# EAGLE design RTC-mini-flip-SHIM (EAGLE 9.6.2)
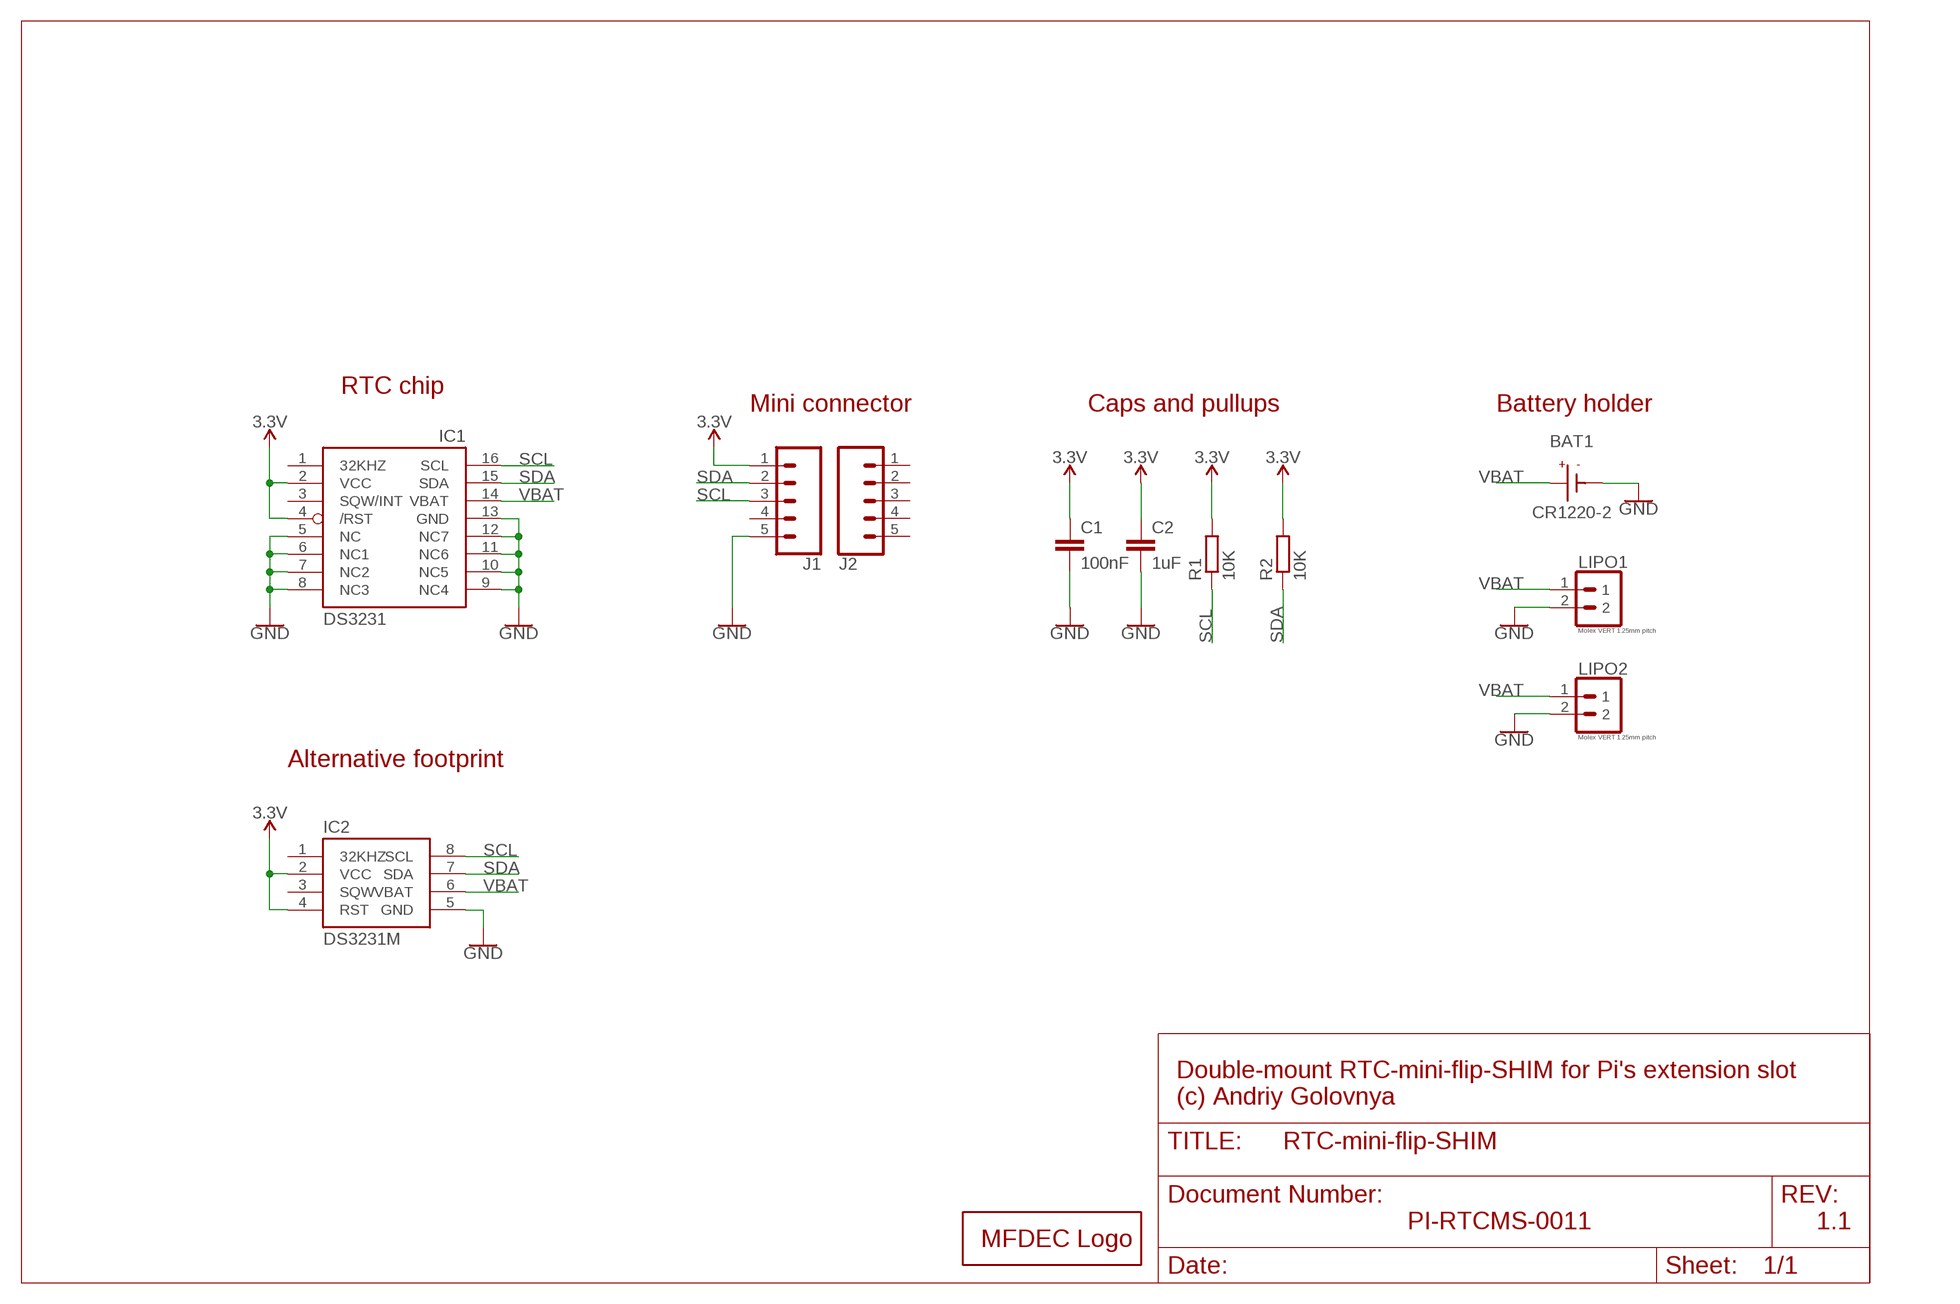
[diagram p0: schematic, sheet 1]

## Parts
BAT1  CR1220-2  [CR1220-2]
C1  100nF  C-EUC0402  [C0402]
C2  1uF  C-EUC0603  [C0603]
IC1  DS3231/SO  [SO16W]
IC2  DS3231M  [SO08]
J1  CONN_05LOCK  [1X05_LOCK]
J2  CONN_05LOCK  [1X05_LOCK]
LIPO1  Molex VERT 1.25mm pitch  1X02_MOLEX_0530470210_VERT-MALE_PITCH-1.25MM  [_MOLEX-0530470210_VERT_PITCH-1.25MM]
LIPO2  Molex VERT 1.25mm pitch  1X02_MOLEX_0530470210_VERT-MALE_PITCH-1.25MM  [_MOLEX-0530470210_VERT_PITCH-1.25MM]
LOGO1  MFDECLOGO_L_10MM  [MFDEC_L_10MM]
R1  10K  R-EU_R0402  [R0402]
R2  10K  R-EU_R0402  [R0402]

## Nets
3.3V: C1.1 C2.1 IC1.2(VCC) IC1.4(/RST) IC2.2(VCC) IC2.4(RST) J1.1 R1.2 R2.2
GND: BAT1.BAT- C1.2 C2.2 IC1.5(NC) IC1.6(NC1) IC1.7(NC2) IC1.8(NC3) IC1.9(NC4) IC1.10(NC5) IC1.11(NC6) IC1.12(NC7) IC1.13(GND) IC2.5(GND) J1.5 LIPO1.2 LIPO2.2
SCL: IC1.16(SCL) IC2.8(SCL) J1.3 R1.1
SDA: IC1.15(SDA) IC2.7(SDA) J1.2 R2.1
VBAT: BAT1.BAT+ IC1.14(VBAT) IC2.6(VBAT) LIPO1.1 LIPO2.1
Unconnected: IC1.1(32KHZ) IC1.3(SQW/INT) IC2.1(32KHZ) IC2.3(SQW) J1.4 J2.1 J2.2 J2.3 J2.4 J2.5

## Notes on the sheet
- RTC chip
- Mini connector | Caps and pullups | Battery holder
- Alternative footprint
- Double-mount RTC-mini-flip-SHIM for Pi's extension slot
  (c) Andriy Golovnya
- PI-RTCMS-0011 | 1.1

## Library data of the parts
BAT1 = CR1220-2:CR1220-2
C1 C2 = rcl:C-EU: CAPACITOR, European symbol; SPICEPREFIX: C
IC1 = adafruit:DS3231
IC2 = SparkFun-Clocks:DS3231M: DS3231M Real Time Clock Accuracy +/-5ppm. Battery Backup. 2.3V to 5.5V. Datasheet <https://cdn.sparkfun.com/datasheets/Dev/Beagle/DS3231M.pdf> SparkFun Products CryptoCape <https://www.sparkfun.com/products/12773> (DEV-12773) SparkFun CryptoShield <https://www.sparkfun.com/products/13183> (DEV-13183); PROD_ID: IC-11985
J1 J2 = _my_locked_connectors:CONN_05: Multi connection point. Often used as Generic Header-pin footprint for 0.1 inch spaced/style header connections On any of the 0.1 inch spaced packages, you can populate with these: Break Away Headers - Straight <https://www.sparkfun.com/products/116> (PRT-00116) Break Away Male Headers - Right Angle <https://www.sparkfun.com/products/553> (PRT-00553) Female Headers <https://www.sparkfun.com/products/115> (PRT-00115) Break Away Headers - Machine Pin <https://www.sparkfun.com/products/117> (PRT-00117) Break Away Female Headers - Swiss Machine Pin <https://www.sparkfun.com/products/743> (PRT-00743) For SCREWTERMINALS and SPRING TERMINALS visit here: Screw Terimnals on SparkFun.com <https://www.sparkfun.com/search/results?term=Screw+Terminals> (5mm/3.5mm/2.54mm spacing) This device is also useful as a general connection point to wire up your design to another part of your project. Our various solder wires solder well into these plated through hole pads. Hook-Up Wire - Assortment (Stranded, 22 AWG) <https://www.sparkfun.com/products/11375> (PRT-11375) Hook-Up Wire - Assortment (Solid Core, 22 AWG) <https://www.sparkfun.com/products/11367> (PRT-11367) View the entire wire category on our website here <https://www.sparkfun.com/categories/141> Special notes: Molex polarized connector foot print use with SKU : PRT-08231 with associated crimp pins and housings. 1MM SMD Version SKU: PRT-10208
LIPO1 LIPO2 = PiB_connectors:1X02_MOLEX; DATASHEET_CONNECTOR1: https://www.molex.com/pdm_docs/sd/530470210_sd.pdf; DATASHEET_CONNECTOR2: https://www.molex.com/pdm_docs/sd/510210700_sd.pdf; DATASHEET_CRIMP: https://www.molex.com/pdm_docs/sd/500798000_sd.pdf; DISTLINK_CONNECTOR1: https://www.digikey.com/products/en?keywords=WM1731-ND; DISTLINK_CONNECTOR2: https://www.digikey.com/products/en?keywords=WM1720-ND; DISTLINK_CRIMP: https://www.digikey.com/products/en?keywords=WM1142CT-ND; DISTPN_CONNECTOR1: WM1731-ND; DISTPN_CONNECTOR2: WM1720-ND; DISTPN_CRIMP: WM1142CT-ND; DIST_CONNECTOR1: Digikey; DIST_CONNECTOR2: Digikey; DIST_CRIMP: Digikey; MFR_CONNECTOR1: Molex, LLC; MFR_CONNECTOR2: Molex, LLC; MFR_CRIMP: Molex, LLC; MPN_CONNECTOR1: 0530470210; MPN_CONNECTOR2: 51021-0200; MPN_CRIMP: 0500798000
LOGO1 = _my_logos:MFDECLOGO: Midnight Fog - Digital Eye Candy LOGO
R1 R2 = rcl:R-EU_: RESISTOR, European symbol; SPICEPREFIX: R

## Board
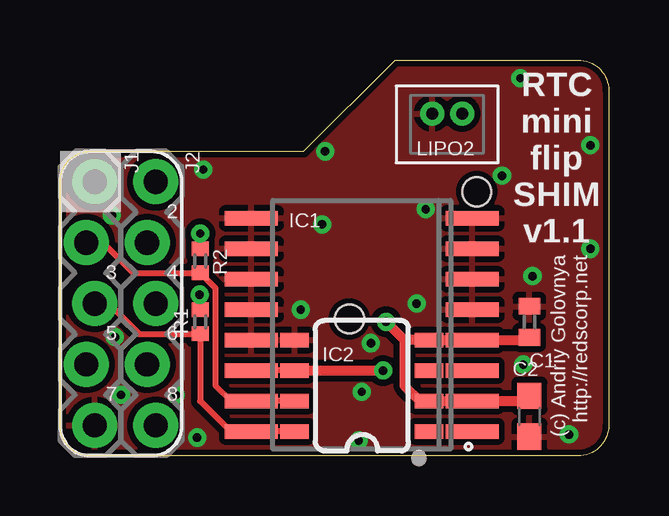
[diagram p1: board, top side]
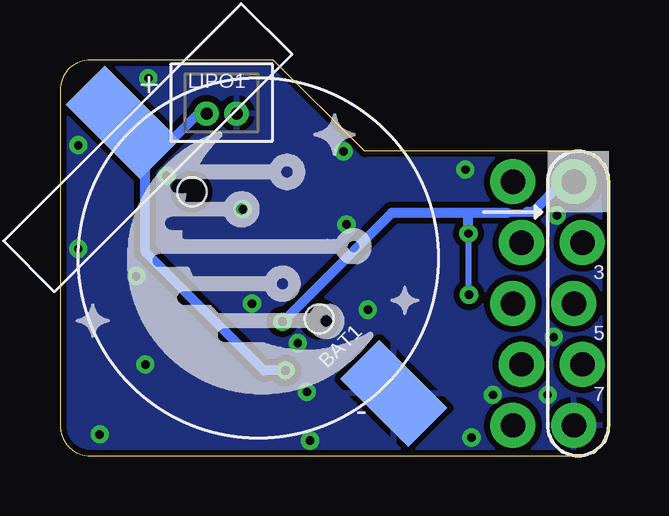
[diagram p2: board, bottom side, seen from below]

Size 22.86 x 16.51 mm. Coordinates in mm from the lower left corner, seen from the top.
Outline: 0,1.27 0,11.43 arc-90 1.27,12.7 10.16,12.7 13.97,16.51 21.59,16.51 arc-90 22.86,15.24 22.86,1.27 arc-90 21.59,0 1.27,0 arc-90 0,1.27
Copper layers (1*16): Top 0.035mm / dielectric 1.5mm / Bottom 0.035mm
Design rules "default *": minimum track width 6mil, minimum drill 0.35mm, track to track 6mil, track to pad 6mil, pad to pad 6mil, via to via 6mil, smd to smd 6mil, copper to edge 6mil, drill to drill 6mil, minimum pad ring 10mil, minimum via ring 8mil, stop-mask expansion 4mil, vias tented up to drill 20mil, thermal gap 10mil

### Footprints (pad centres in the part's own frame; a part is rotated, then mirrored left to right if it is on the bottom)
CR1220-2 = smd 2.3 x 4.4: BAT+ 0,-8 | smd 2.3 x 4: BAT- 0,8 | hole 1.2: 0,3.6; 0,-3.9
C0402 = smd 0.7 x 0.9: 1 -0.65,0; 2 0.65,0
C0603 = smd 1.1 x 1: 1 -0.85,0; 2 0.85,0
SO16W = smd 0.6 x 2.2: 1 -4.445,-4.6; 2 -3.175,-4.6; 3 -1.905,-4.6; 4 -0.635,-4.6; 5 0.635,-4.6; 6 1.905,-4.6; 7 3.175,-4.6; 8 4.445,-4.6; 9 4.445,4.6; 10 3.175,4.6; 11 1.905,4.6; 12 0.635,4.6; 13 -0.635,4.6; 14 -1.905,4.6; 15 -3.175,4.6; 16 -4.445,4.6
SO08 = smd 0.6 x 1.2: 1 -1.905,-2.8; 2 -0.635,-2.8; 3 0.635,-2.8; 4 1.905,-2.8; 5 1.905,2.8; 6 0.635,2.8; 7 -0.635,2.8; 8 -1.905,2.8
1X05_LOCK = drill 1.016 pad 1.88: 1 0,0.178; 2 2.54,-0.178; 3 5.08,0.178; 4 7.62,-0.178; 5 10.16,0.178
_MOLEX-0530470210_VERT_PITCH-1.25MM = drill 0.5: 1 -0.625,0; 2 0.625,0
R0402 = smd 0.6 x 0.7: 1 -0.5,0; 2 0.5,0

### Placement (x,y rotation side)
BAT1  14.61,8.26 225 bottom
C1  19.56,5.59 90 top
C2  19.56,1.65 270 top
IC1  12.57,5.46 90 top
IC2  12.57,2.92 90 top
J1  1.27,11.43 270 top
J2  3.81,11.43 270 top
LIPO1  16.13,14.27 0 bottom
LIPO2  16.13,14.27 180 top
LOGO1  22.99,1.65 0 bottom
R1  5.84,5.59 90 top
R2  5.84,8.13 90 top

### Tracks (layer width: path | path; a pad name or v marks a point on that pad's centre or on a via)
3.3V  (via drill 0.35)
  Top 0.254: R1.2 5.82,6.11 v5.82,6.72 | v5.84,9.27 R2.2
  Top 0.406: C1.1 19.45,4.83 IC1.4 IC2.4 14.35,4.83 | v13.59,5.59 14.35,4.83 | 14.35,4.83 14.35,2.92 14.99,2.29 IC2.2 IC1.2 19.34,2.29 C2.1
  Bottom 0.254: v5.82,6.72 5.82,9.25 v5.84,9.27
  Bottom 0.305: 4.22,10.13 3.45,10.13 3.4,10.19
  Bottom 0.406: J1.1 1.91,11.43 3.15,10.19 3.4,10.19 | v13.59,5.59 9.04,10.13 5.84,10.13 | 4.22,10.13 5.84,10.13 | v5.84,9.27 5.84,10.13
GND  (via drill 0.35)
  other vias: 2.54,2.54 4.83,2.54 5.97,11.94 2.16,10.03 2.29,4.95 12.57,2.67 5.71,0.76 10.03,6.1 12.95,4.7 14.86,6.35 19.18,15.75 22.1,12.95 11.05,12.7 21.21,0.89 19.3,3.81 19.68,7.49 18.41,11.68 22.1,8.64 10.92,9.65 12.45,0.64 15.24,10.29
  pour Top (isolate 0.254): 0,0 0,16.51 25.4,16.51 25.4,0
  pour Bottom (isolate 0.254): -2.54,0 -2.54,16.51 22.86,16.51 22.86,0
SCL
  Top 0.254: J1.3 2.03,6.35 3.3,5.08 R1.1 5.84,2.29 7.11,1.02 IC1.16 IC2.8
SDA
  Top 0.254: J1.2 1.78,8.89 3.05,7.62 R2.1 6.48,6.99 6.48,2.92 7.11,2.29 IC1.15 IC2.7
VBAT  (via drill 0.35)
  Top 0.254: IC2.6 IC1.14
  Top 0.406: IC2.6 v13.46,3.56
  Bottom 0.406: LIPO2.1 17.09,14.28 18.16,13.21 19.56,13.21 BAT1.BAT+ 19.3,12.95 19.3,8.51 14.35,3.56 v13.46,3.56

### Text on the board
tPlace: 2 | RTC / mini / flip / SHIM / v1.1 | (c) Andriy Golovnya / http://redscorp.net | 3 | 4 | 5 | 6 | 7 | 8
bPlace: + | 3 | 5 | 7 | -